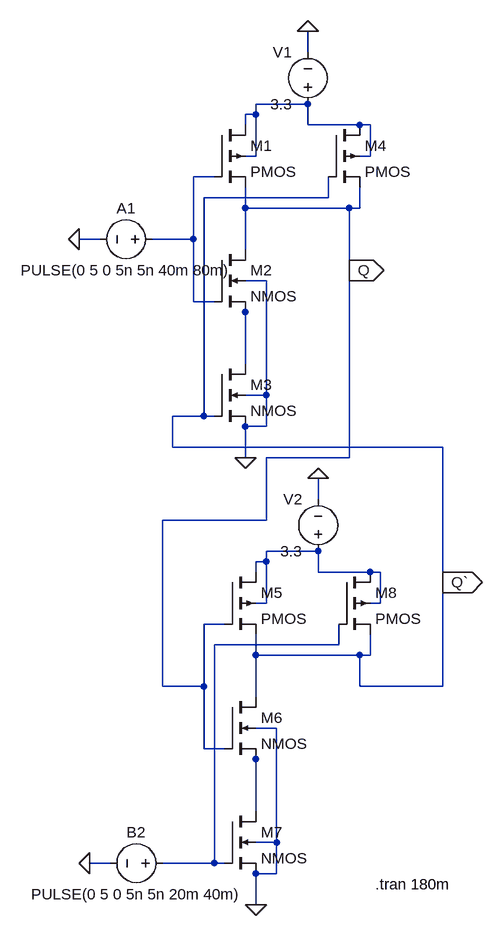
[diagram p0: schematic SRLATCH.asc]
SRLATCH.asc, the LTspice schematic file:
Version 4
SHEET 1 880 1172
WIRE 240 -160 240 -192
WIRE 240 -80 160 -80
WIRE 160 -64 160 -80
WIRE 160 -64 144 -64
WIRE 144 -48 144 -64
WIRE 240 -48 240 -80
WIRE 320 -48 240 -48
WIRE 336 -48 320 -48
WIRE 160 0 160 -64
WIRE 160 0 144 0
WIRE 336 0 336 -48
WIRE 336 0 320 0
WIRE 96 32 64 32
WIRE 272 64 272 32
WIRE 272 64 80 64
WIRE 144 80 144 48
WIRE 304 80 144 80
WIRE 320 80 320 48
WIRE 320 80 304 80
WIRE -80 128 -112 128
WIRE 64 128 64 32
WIRE 64 128 0 128
WIRE 144 144 144 80
WIRE 304 176 304 80
WIRE 176 192 144 192
WIRE 64 224 64 128
WIRE 96 224 64 224
WIRE 144 240 144 224
WIRE 144 320 144 240
WIRE 176 368 176 192
WIRE 176 368 144 368
WIRE 80 400 80 64
WIRE 80 400 32 400
WIRE 96 400 80 400
WIRE 176 416 176 368
WIRE 176 416 144 416
WIRE 32 448 32 400
WIRE 448 448 32 448
WIRE 144 464 144 416
WIRE 304 464 304 176
WIRE 304 464 176 464
WIRE 256 528 256 496
WIRE 176 560 176 464
WIRE 176 560 16 560
WIRE 256 608 176 608
WIRE 176 624 176 608
WIRE 176 624 160 624
WIRE 160 640 160 624
WIRE 256 640 256 608
WIRE 336 640 256 640
WIRE 352 640 336 640
WIRE 448 656 448 448
WIRE 176 688 176 624
WIRE 176 688 160 688
WIRE 352 688 352 640
WIRE 352 688 336 688
WIRE 112 720 80 720
WIRE 288 752 288 720
WIRE 288 752 96 752
WIRE 160 768 160 736
WIRE 320 768 160 768
WIRE 336 768 336 736
WIRE 336 768 320 768
WIRE 16 816 16 560
WIRE 80 816 80 720
WIRE 80 816 16 816
WIRE 320 816 320 768
WIRE 448 816 448 656
WIRE 448 816 320 816
WIRE 160 832 160 768
WIRE 192 880 160 880
WIRE 80 912 80 816
WIRE 112 912 80 912
WIRE 160 928 160 912
WIRE 160 1008 160 928
WIRE 192 1056 192 880
WIRE 192 1056 160 1056
WIRE -64 1088 -96 1088
WIRE 96 1088 96 752
WIRE 96 1088 16 1088
WIRE 112 1088 96 1088
WIRE 192 1104 192 1056
WIRE 192 1104 160 1104
WIRE 160 1152 160 1104
FLAG 144 464 0
FLAG 240 -192 0
FLAG -112 128 0
FLAG 160 1152 0
FLAG 256 496 0
FLAG -96 1088 0
FLAG 304 176 Q
IOPIN 304 176 Out
FLAG 448 656 Q`
IOPIN 448 656 Out
SYMBOL pmos4 96 -48 R0
SYMATTR InstName M1
SYMATTR Value2 l=1040nm w=1040nm
SYMBOL nmos4 96 144 R0
SYMATTR InstName M2
SYMATTR Value2 l=1040nm w=1040nm
SYMBOL nmos4 96 320 R0
SYMATTR InstName M3
SYMATTR Value2 l=1040nm w=1040nm
SYMBOL voltage 240 -64 R180
WINDOW 0 24 96 Left 2
WINDOW 3 24 16 Left 2
WINDOW 123 0 0 Left 0
WINDOW 39 0 0 Left 0
SYMATTR InstName V1
SYMATTR Value 3.3
SYMBOL voltage 16 128 R90
WINDOW 0 -32 56 VBottom 2
WINDOW 3 32 56 VTop 2
WINDOW 123 0 0 Left 0
WINDOW 39 0 0 Left 0
SYMATTR InstName A1
SYMATTR Value PULSE(0 5 0 5n 5n 40m 80m)
SYMBOL pmos4 272 -48 R0
SYMATTR InstName M4
SYMBOL pmos4 112 640 R0
SYMATTR InstName M5
SYMATTR Value2 l=1040nm w=1040nm
SYMBOL nmos4 112 832 R0
SYMATTR InstName M6
SYMATTR Value2 l=1040nm w=1040nm
SYMBOL nmos4 112 1008 R0
SYMATTR InstName M7
SYMATTR Value2 l=1040nm w=1040nm
SYMBOL voltage 256 624 R180
WINDOW 0 24 96 Left 2
WINDOW 3 24 16 Left 2
WINDOW 123 0 0 Left 0
WINDOW 39 0 0 Left 0
SYMATTR InstName V2
SYMATTR Value 3.3
SYMBOL voltage 32 1088 R90
WINDOW 0 -32 56 VBottom 2
WINDOW 3 32 56 VTop 2
WINDOW 123 0 0 Left 0
WINDOW 39 0 0 Left 0
SYMATTR InstName B2
SYMATTR Value PULSE(0 5 0 5n 5n 20m 40m)
SYMBOL pmos4 288 640 R0
SYMATTR InstName M8
TEXT 344 1120 Left 2 !.tran 180m

The netlist it stands for:
* SRLATCH.asc
M1 N001 N002 Q N001 PMOS l=1040nm w=1040nm
M2 Q N002 N003 0 NMOS l=1040nm w=1040nm
M3 N003 Q` 0 0 NMOS l=1040nm w=1040nm
V1 N001 0 3.3
V§A1 N002 0 PULSE(0 5 0 5n 5n 40m 80m)
M4 N001 Q` Q N001 PMOS
M5 N004 Q Q` N004 PMOS l=1040nm w=1040nm
M6 Q` Q N006 0 NMOS l=1040nm w=1040nm
M7 N006 N005 0 0 NMOS l=1040nm w=1040nm
V2 N004 0 3.3
V§B2 N005 0 PULSE(0 5 0 5n 5n 20m 40m)
M8 N004 N005 Q` N004 PMOS
.model NMOS NMOS
.model PMOS PMOS
.lib standard.mos
.tran 180m
.backanno
.end